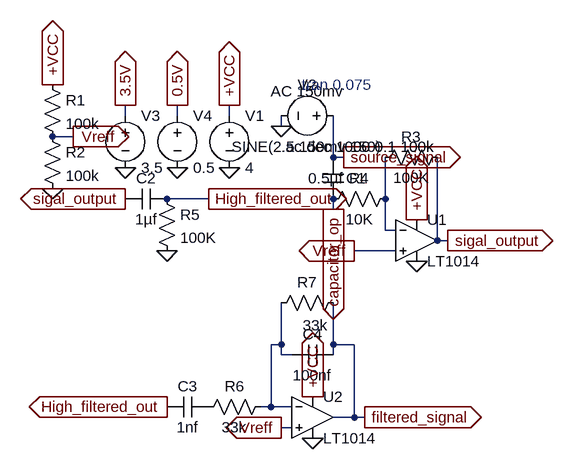
[diagram p0: schematic signal_amplifier - Copy.asc]
signal_amplifier - Copy.asc, the LTspice schematic file:
Version 4
SHEET 1 880 680
WIRE -560 -160 -560 -176
WIRE -480 -160 -480 -176
WIRE -400 -160 -400 -176
WIRE -320 -144 -320 -160
WIRE -640 -128 -672 -128
WIRE -240 -96 -240 -160
WIRE -224 -96 -240 -96
WIRE -432 -32 -496 -32
WIRE -160 -32 -160 -96
WIRE -240 -16 -240 -32
WIRE -160 16 -160 -32
WIRE -144 16 -160 16
WIRE -80 32 -80 -96
WIRE -64 32 -80 32
WIRE -144 48 -208 48
WIRE -320 192 -320 128
WIRE -320 192 -336 192
WIRE -240 192 -240 128
WIRE -208 192 -240 192
WIRE -320 208 -320 192
WIRE -304 208 -320 208
WIRE -240 208 -240 192
WIRE -336 288 -336 192
WIRE -336 288 -352 288
WIRE -304 288 -336 288
WIRE -208 304 -208 192
WIRE -208 304 -240 304
WIRE -192 304 -208 304
WIRE -304 320 -320 320
FLAG -64 32 sigal_output
IOPIN -64 32 Out
FLAG -112 64 0
FLAG -400 -176 +VCC
IOPIN -400 -176 Out
FLAG -400 -80 0
FLAG -672 -48 0
FLAG -672 -208 +VCC
IOPIN -672 -208 Out
FLAG -112 0 +VCC
IOPIN -112 0 Out
FLAG -640 -128 Vreff
IOPIN -640 -128 Out
FLAG -208 48 Vreff
IOPIN -208 48 Out
FLAG -320 -144 0
FLAG -240 -16 capacitor_op
IOPIN -240 -16 Out
FLAG -224 -96 source_signal
IOPIN -224 -96 Out
FLAG -560 -80 0
FLAG -560 -176 3.5V
IOPIN -560 -176 Out
FLAG -480 -80 0
FLAG -480 -176 0.5V
IOPIN -480 -176 Out
FLAG -496 48 0
FLAG -560 -32 sigal_output
IOPIN -560 -32 Out
FLAG -432 -32 High_filtered_out
IOPIN -432 -32 Out
FLAG -320 320 Vreff
IOPIN -320 320 Out
FLAG -272 272 +VCC
IOPIN -272 272 Out
FLAG -272 336 0
FLAG -192 304 filtered_signal
IOPIN -192 304 Out
FLAG -496 288 High_filtered_out
IOPIN -496 288 Out
SYMBOL OpAmps\\LT1014 -112 -32 R0
SYMATTR InstName U1
SYMBOL voltage -400 -176 R0
WINDOW 123 0 0 Left 0
WINDOW 39 0 0 Left 0
SYMATTR InstName V1
SYMATTR Value 4
SYMBOL res -688 -224 R0
SYMATTR InstName R1
SYMATTR Value 100k
SYMBOL res -688 -144 R0
SYMATTR InstName R2
SYMATTR Value 100k
SYMBOL res -64 -112 R90
WINDOW 0 0 56 VBottom 2
WINDOW 3 32 56 VTop 2
SYMATTR InstName R3
SYMATTR Value 100K
SYMBOL res -144 -48 R90
WINDOW 0 0 56 VBottom 2
WINDOW 3 32 56 VTop 2
SYMATTR InstName R4
SYMATTR Value 10K
SYMBOL cap -256 -96 R0
WINDOW 0 36 32 Left 2
WINDOW 3 -23 32 Left 2
SYMATTR InstName C1
SYMATTR Value 0.5µf
SYMBOL voltage -224 -160 R90
WINDOW 0 -32 56 VBottom 2
WINDOW 3 32 56 VTop 2
WINDOW 123 -22 56 VBottom 2
WINDOW 39 0 0 Left 0
SYMATTR InstName V2
SYMATTR Value SINE(2.5 150mv 150)
SYMATTR Value2 AC 150mv
SYMBOL voltage -560 -176 R0
WINDOW 123 0 0 Left 0
WINDOW 39 0 0 Left 0
SYMATTR InstName V3
SYMATTR Value 3.5
SYMBOL voltage -480 -176 R0
WINDOW 123 0 0 Left 0
WINDOW 39 0 0 Left 0
SYMATTR InstName V4
SYMATTR Value 0.5
SYMBOL cap -496 -48 R90
WINDOW 0 0 32 VBottom 2
WINDOW 3 32 32 VTop 2
SYMATTR InstName C2
SYMATTR Value 1µf
SYMBOL res -512 -48 R0
SYMATTR InstName R5
SYMATTR Value 100K
SYMBOL OpAmps\\LT1014 -272 240 R0
SYMATTR InstName U2
SYMBOL cap -432 272 R90
WINDOW 0 0 32 VBottom 2
WINDOW 3 32 32 VTop 2
SYMATTR InstName C3
SYMATTR Value 1nf
SYMBOL res -336 272 R90
WINDOW 0 0 56 VBottom 2
WINDOW 3 32 56 VTop 2
SYMATTR InstName R6
SYMATTR Value 33k
SYMBOL cap -240 192 R90
WINDOW 0 0 32 VBottom 2
WINDOW 3 32 32 VTop 2
SYMATTR InstName C4
SYMATTR Value 100nf
SYMBOL res -224 112 R90
WINDOW 0 0 56 VBottom 2
WINDOW 3 35 44 VTop 2
SYMATTR InstName R7
SYMATTR Value 33k
TEXT -296 -208 Left 2 ;.tran 0.075
TEXT -320 -112 Left 2 !.ac dec 1000 0.1 100k

The netlist it stands for:
* signal_amplifier - Copy.asc
XU1 Vreff N001 +VCC 0 sigal_output LT1014  ; pins In+ In- V+ V- OUT
V1 +VCC 0 4
R1 +VCC Vreff 100k
R2 Vreff 0 100k
R3 sigal_output N001 100K
R4 N001 capacitor_op 10K
C1 source_signal capacitor_op 0.5µf
V2 source_signal 0 SINE(2.5 150mv 150) AC 150mv
V3 3.5V 0 3.5
V4 0.5V 0 0.5
C2 High_filtered_out sigal_output 1µf
R5 High_filtered_out 0 100K
XU2 Vreff N002 +VCC 0 filtered_signal LT1014  ; pins In+ In- V+ V- OUT
C3 P001 High_filtered_out 1nf
R6 N002 P001 33k
C4 filtered_signal N002 100nf
R7 filtered_signal N002 33k
* .tran 0.075
.ac dec 1000 0.1 100k
.backanno
.end